# Altium project PCB_Project.PrjPcb
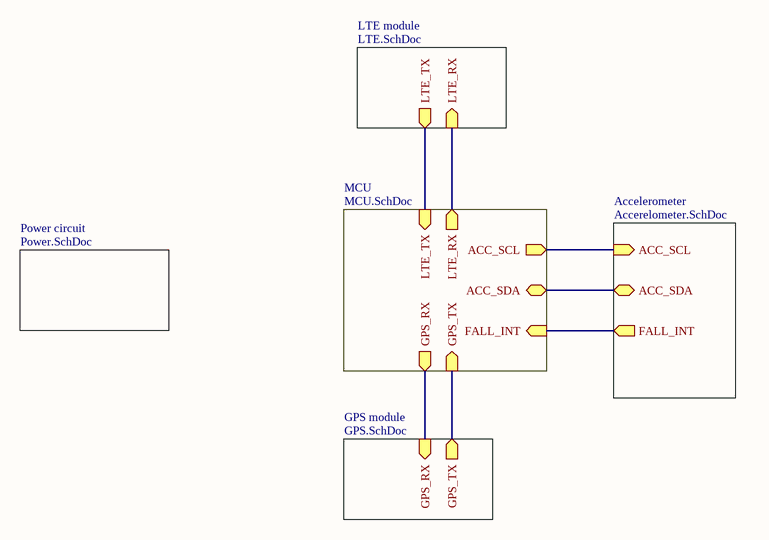
[diagram p0: Block digram.SchDoc]
6 sheets, 107 parts. Net scope: hierarchical (ports join the sheet entries above them; power ports are global).
Board file: PCB_v1.PcbDoc
Sheets:
  Block digram.SchDoc
    Power circuit = Power.SchDoc
    Accelerometer = Accerelometer.SchDoc
    GPS module = GPS.SchDoc
    LTE module = LTE.SchDoc
    MCU = MCU.SchDoc

## Sheet Block digram.SchDoc: Block diagram
size A4; Date: 3-7-2020; Author: Tim Chien; DrawnBy: Tim Chien; DocumentNumber: 1; Revision: 1-1; SheetNumber: 1; SheetTotal: 6; Time: 23:47

### Sub-sheets
Accelerometer = Accerelometer.SchDoc: ACC_SCL (in), ACC_SDA (bidir), FALL_INT (out)
GPS module = GPS.SchDoc: GPS_TX (out), GPS_RX (in)
LTE module = LTE.SchDoc: LTE_TX (out), LTE_RX (in)
MCU = MCU.SchDoc: GPS_RX (out), GPS_TX (in), ACC_SCL (out), ACC_SDA (bidir), FALL_INT (in), LTE_TX (in), LTE_RX (out)
Power circuit = Power.SchDoc: no entries

### Nets
ACC_SCL: sheet Accelerometer/ACC_SCL, sheet MCU/ACC_SCL
ACC_SDA: sheet Accelerometer/ACC_SDA, sheet MCU/ACC_SDA
FALL_INT: sheet Accelerometer/FALL_INT, sheet MCU/FALL_INT
GPS_RX: sheet GPS module/GPS_RX, sheet MCU/GPS_RX
GPS_TX: sheet GPS module/GPS_TX, sheet MCU/GPS_TX
LTE_RX: sheet LTE module/LTE_RX, sheet MCU/LTE_RX
LTE_TX: sheet LTE module/LTE_TX, sheet MCU/LTE_TX

### Notes on the sheet
- Title
- Size:
- Date:
- A4
- Number:
- Time:
- Revision:
- Sheet
- of
- File:

## Sheet Power.SchDoc: Power circuit
size A4; Revision: 1-1; SheetNumber: 2; SheetTotal: 6
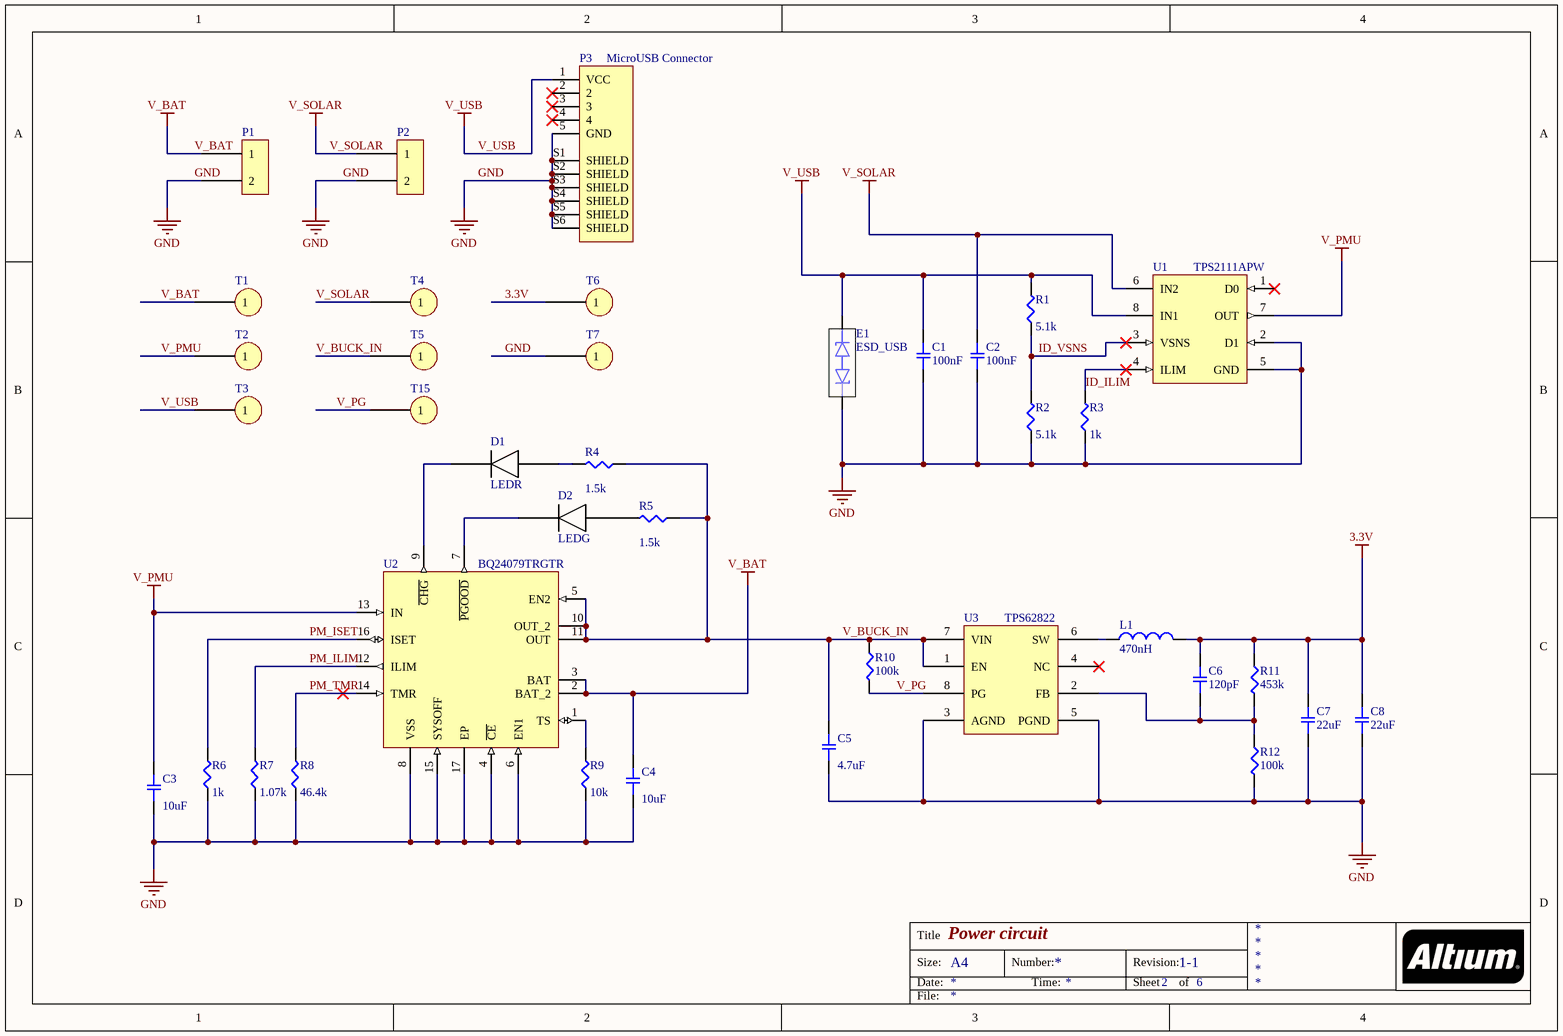
[diagram p1: Power.SchDoc]

### Parts
C1  value 100nF  [1206-CAP]  (hidden comment: 1206C 100NF)
C2  value 100nF  [1206-CAP]  (hidden comment: 1206C 100NF)
C3  value 10uF  [0805-CAP]  (hidden comment: 0805C 10UF)
C4  value 10uF  [0805-CAP]  (hidden comment: 0805C 10UF)
C5  value 4.7uF  [0603-CAP]  (hidden comment: 0603C 4U7F)
C6  value 120pF  [0603-CAP]  (hidden comment: 0603C 120PF)
C7  value 22uF  [1210-CAP]  (hidden comment: 1210C 22UF)
C8  value 22uF  [1210-CAP]  (hidden comment: 1210C 22UF)
D1  LEDR  [0603-LED]
D2  LEDG  [0603-LED]
E1  ESD_USB  [ESD_USB]
L1  value 470nH  [Inductor 470NH]  (hidden comment: Inductor 470NH)
P1  2pins_connector  [2_PINS_2.54]  (value not drawn)
P2  2pins_connector  [2_PINS_2.54]  (value not drawn)
P3  value MicroUSB Connector  [*HRS_ZX62D-B-5P8_ZX62D-B-5P8(Primary)]  (hidden comment: ZX62D-B-5P8)
R1  value 5.1k  [0805-RES]  (hidden comment: 0805R 5K1R)
R2  value 5.1k  [0805-RES]  (hidden comment: 0805R 5K1R)
R3  value 1k  [0603-RES]  (hidden comment: 0603R 1KR)
R4  value 1.5k  [0603-RES]  (hidden comment: 0603R 1K5R)
R5  value 1.5k  [0603-RES]  (hidden comment: 0603R 1K5R)
R6  value 1k  [0603-RES]  (hidden comment: 0603R 1KR)
R7  value 1.07k  [0603-RES]  (hidden comment: 0603R 1K07R)
R8  value 46.4k  [0603-RES]  (hidden comment: 0603R 46K4R)
R9  value 10k  [0603-RES]  (hidden comment: 0603R 10KR)
R10  value 100k  [0805-RES]  (hidden comment: 0805R 100KR)
R11  value 453k  [0805-RES]  (hidden comment: 0805R 453KR)
R12  value 100k  [0805-RES]  (hidden comment: 0805R 100KR)
T1  1pin_header  [1_PIN_2.54]  (value not drawn)
T2  1pin_header  [1_PIN_2.54]  (value not drawn)
T3  1pin_header  [1_PIN_2.54]  (value not drawn)
T4  1pin_header  [1_PIN_2.54]  (value not drawn)
T5  1pin_header  [1_PIN_2.54]  (value not drawn)
T6  1pin_header  [1_PIN_2.54]  (value not drawn)
T7  1pin_header  [1_PIN_2.54]  (value not drawn)
T15  *  [1_PIN_2.54]  (value not drawn)
U1  TPS2111APW  [*SOP65P640X120-8N]
U2  BQ24079TRGTR  [*QFN50P300X300X100-17N]
U3  TPS62822  [SON50P150X100_HS-9N]

### Nets
3.3V: C6.2 C7.2 C8.2 L1.2 R11.1 T6.1
GND: C1.1 C2.1 C3.1 C4.1 C5.1 C7.1 C8.1 E1.1 P1.2 P2.2 P3.5(GND) P3.S1(SHIELD) P3.S2(SHIELD) P3.S3(SHIELD) P3.S4(SHIELD) P3.S5(SHIELD) P3.S6(SHIELD) R2.1 R3.1 R6.1 R7.1 R8.1 R9.1 R12.2 T7.1 U1.2(D1) U1.5(GND) U2.4(~{CE}) U2.6(EN1) U2.8(VSS) U2.15(SYSOFF) U2.17(EP) U3.3(AGND) U3.5(PGND)
V_BAT: C4.2 P1.1 T1.1 U2.2(BAT_2) U2.3(BAT)
V_PMU: C3.2 T2.1 U1.7(OUT) U2.13(IN)
V_SOLAR: C2.2 P2.1 T4.1 U1.6(IN2)
V_USB: C1.2 E1.2 P3.1(VCC) R1.2 T3.1 U1.8(IN1)
ID_ILIM: R3.2 U1.4(ILIM)
ID_VSNS: R1.1 R2.2 U1.3(VSNS)
PM_ILIM: R7.2 U2.12(ILIM)
PM_ISET: R6.2 U2.16(ISET)
PM_TMR: R8.2 U2.14(TMR)
V_BUCK_IN: C5.2 R4.1 R5.1 R10.1 T5.1 U2.5(EN2) U2.10(OUT_2) U2.11(OUT) U3.1(EN) U3.7(VIN)
V_PG: R10.2 T15.1 U3.8(PG)
NetC6_1: C6.1 R11.2 R12.1 U3.2(FB)
NetD1_1: D1.1 R4.2
NetD1_2: D1.2 U2.9(~{CHG})
NetD2_1: D2.1 R5.2
NetD2_2: D2.2 U2.7(~{PGOOD})
NetL1_1: L1.1 U3.6(SW)
NetR9_2: R9.2 U2.1(TS)

Not connected (* = marked no-connect by the designer): P3 2* 3* 4*; U1 1(D0)*; U3 4(NC)*

### Notes on the sheet
- Title
- Size:
- Date:
- A4
- Number:
- Time:
- Revision:
- Sheet
- of
- File:

### Library data of the parts
D1 = 0603 LEDR: Supplier 1: Digi-Key; Supplier Part Number 1: 160-1181-6-ND
D2 = 0603 LEDG: Supplier 1: Digi-Key; Supplier Part Number 1: 160-1183-6-ND
P1 P2 = 2pins_connector: Bat_connector
P3 = ZX62D-B-5P8: USB - micro B USB 2.0 Receptacle Connector 5 Position Surface Mount, Right Angle; Through Hole; MF: Hirose; SnapEDA_Link: https://www.snapeda.com/parts/ZX62D-B-5P8/Hirose%20Electric%20Co%20Ltd/view-part/110243/?ref=snap; Price: None; Availability: Unavailable; Package: None; MP: ZX62D-B-5P8; Supplier 1: Digi-Key; Supplier Part Number 1: 609-5379-6-ND
T15 = 1pin_header
U1 = TPS2111APW: OR Controller Source Selector Switch N-Channel 2:1 8-TSSOP; MF: Texas Instruments; MP: TPS2110APWR; Package: TSSOP-8 Texas Instruments; Price: 2.34; SnapEDA_Link: https://www.snapeda.com/parts/TPS2111APW/Texas%20Instruments/view-part/299213/?ref=snap; Value: *; datasheet link: https://www.ti.com/lit/ds/symlink/tps2111a.pdf; Digikey link: https://www.digikey.com/product-detail/en/texas-instruments/TPS2110APWR/296-16935-1-ND/652789; Supplier 1: Digi-Key; Supplier Part Number 1: 296-26917-5-ND
U2 = BQ24079TRGTR: MF: Texas Instruments; MP: BQ24079RGTR; SnapEDA_Link: https://www.snapeda.com/parts/BQ24079TRGTR/Texas%20Instruments/view-part/144669/?ref=snap; Value: *; Digikey link: https://www.digikey.com/product-detail/en/texas-instruments/BQ24079RGTR/296-24815-1-ND/2094655; Package: 16-VFQFN Exposed Pad; Price: 2.21; Datasheet link: http://www.ti.com/lit/ds/symlink/bq24079.pdf; Supplier 1: Digi-Key; Supplier Part Number 1: 296-24815-1-ND
U3 = TPS62822: MF: Texas Instruments; MP: TPS62822DLCR; datasheet link: http://www.ti.com/lit/ds/symlink/tps62822.pdf; Digikey number: 296-50424-1-ND; Package: 8-VFDFN; digikey link: https://www.digikey.com/product-detail/en/texas-instruments/TPS62822DLCR/296-50424-1-ND/9685563; Supplier 1: Digi-Key; Supplier Part Number 1: 296-50424-1-ND
C1 C2 = 1206C 100NF: Package: 1206; Supplier 1: Digi-Key; Supplier Part Number 1: 311-1179-6-ND
C3 C4 = 0805C 10UF: Supplier 1: Digi-Key; Supplier Part Number 1: 445-7617-1-ND
C5 = 0603C 4U7F: Supplier 1: Digi-Key; Supplier Part Number 1: 399-3482-1-ND
C6 = 0603C 120PF: Supplier 1: Digi-Key; Supplier Part Number 1: 490-1429-1-ND
C7 C8 = 1210C 22UF: Supplier 1: Digi-Key; Supplier Part Number 1: 490-10560-1-ND
E1 = ESD_USB: Supplier 1: Digi-Key; Supplier Part Number 1: 1727-3838-1-ND
L1 = Inductor 470NH: Supplier 1: Digi-Key; Supplier Part Number 1: 445-3878-1-ND
R1 R2 = 0805R 5K1R: Supplier 1: Digi-Key; Supplier Part Number 1: 2019-RK73H2ATTD5101FCT-ND
R3 R6 = 0603R 1KR: Package: 0603; Supplier 1: Digi-Key; Supplier Part Number 1: 311-1.00KHRDKR-ND
R4 R5 = 0603R 1K5R: Package: 0603; Supplier 1: Digi-Key; Supplier Part Number 1: 311-1.50KHRCT-ND
R7 = 0603R 1K07R: Package: 0603; Supplier 1: Digi-Key; Supplier Part Number 1: 311-1.07KHRCT-ND
R8 = 0603R 46K4R: Package: 0603; Supplier 1: Digi-Key; Supplier Part Number 1: 311-46.4KHRCT-ND
R9 = 0603R 10KR: Package: 0603; Supplier 1: Digi-Key; Supplier Part Number 1: 311-10.0KHRCT-ND
R10 R12 = 0805R 100KR: Supplier 1: Digi-Key; Supplier Part Number 1: P100KCCT-ND
R11 = 0805R 453KR: Supplier 1: Digi-Key; Supplier Part Number 1: P453KCCT-ND

## Sheet Accerelometer.SchDoc: Accelerometer (MMA8452Q) circuit
size A4; Revision: 1-1; SheetNumber: 4; SheetTotal: 6
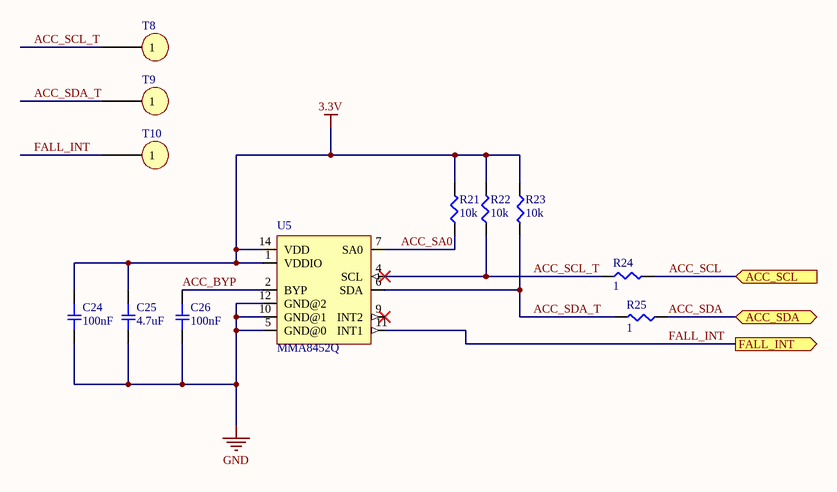
[diagram p2: Accerelometer.SchDoc]

### Parts
C24  value 100nF  [0603-CAP]  (hidden comment: 0603C 100NF)
C25  value 4.7uF  [0603-CAP]  (hidden comment: 0603C 4U7F)
C26  value 100nF  [0603-CAP]  (hidden comment: 0603C 100NF)
R21  value 10k  [0603-RES]  (hidden comment: 0603R 10KR)
R22  value 10k  [0603-RES]  (hidden comment: 0603R 10KR)
R23  value 10k  [0603-RES]  (hidden comment: 0603R 10KR)
R24  value 1  [0603-RES]  (hidden comment: 0603R 1R)
R25  value 1  [0603-RES]  (hidden comment: 0603R 1R)
T8  1pin_test  [1_PIN_test]  (value not drawn)
T9  1pin_test  [1_PIN_test]  (value not drawn)
T10  1pin_test  [1_PIN_test]  (value not drawn)
U5  MMA8452Q  [*QFN-16_0.5MM]

### Ports
ACC_SCL (in), ACC_SDA (bidir), FALL_INT (out)

### Nets
3.3V: C24.1 C25.1 R21.2 R22.2 R23.1 U5.1(VDDIO) U5.14(VDD)
GND: C24.2 C25.2 C26.2 U5.5(GND@0) U5.10(GND@1) U5.12(GND@2)
ACC_BYP: C26.1 U5.2(BYP)
ACC_SA0: R21.1 U5.7(SA0)
ACC_SCL: R24.2 ; port ACC_SCL
ACC_SCL_T: R22.1 R24.1 T8.1 U5.4(SCL)
ACC_SDA: R25.1 ; port ACC_SDA
ACC_SDA_T: R23.2 R25.2 T9.1 U5.6(SDA)
FALL_INT: T10.1 U5.11(INT1) ; port FALL_INT

Not connected (* = marked no-connect by the designer): U5 9(INT2)*

### Notes on the sheet
- Title
- Size:
- Date:
- A4
- Number:
- Time:
- Revision:
- Sheet
- of
- File:

### Library data of the parts
U5 = MMA8452Q: Accelerometer X, Y, Z Axis , 2g, 4g, 8g 0.78Hz ~ 400Hz 16-QFN _3x3_; MP: MMA8452QR1; MF: NXP Semiconductors; Price: 1.147; Package: 16-VFQFN; Availability: Unavailable; SnapEDA_Link: https://www.snapeda.com/parts/MMA8452Q/NXP%20Semiconductors/view-part/4219708/?ref=snap; Value: *; Digikey link: https://www.digikey.com/product-detail/en/nxp-usa-inc/MMA8452QR1/MMA8452QR1TR-ND/2508917; Datasheet link: https://www.nxp.com/docs/en/data-sheet/MMA8451Q.pdf; Supplier 1: Digi-Key; Supplier Part Number 1: MMA8452QR1CT-ND
C24 C26 = 0603C 100NF: Supplier 1: Digi-Key; Supplier Part Number 1: 490-8020-1-ND
C25 = 0603C 4U7F: Supplier 1: Digi-Key; Supplier Part Number 1: 399-3482-1-ND
R21-R23 = 0603R 10KR: Package: 0603; Supplier 1: Digi-Key; Supplier Part Number 1: 311-10.0KHRCT-ND
R24 R25 = 0603R 1R: Package: 0603; Supplier 1: Digi-Key; Supplier Part Number 1: 311-1.00HRCT-ND

## Sheet GPS.SchDoc: GPS (SAM-M8Q) circuit
size A4; Revision: 1-1; SheetNumber: 5; SheetTotal: 6
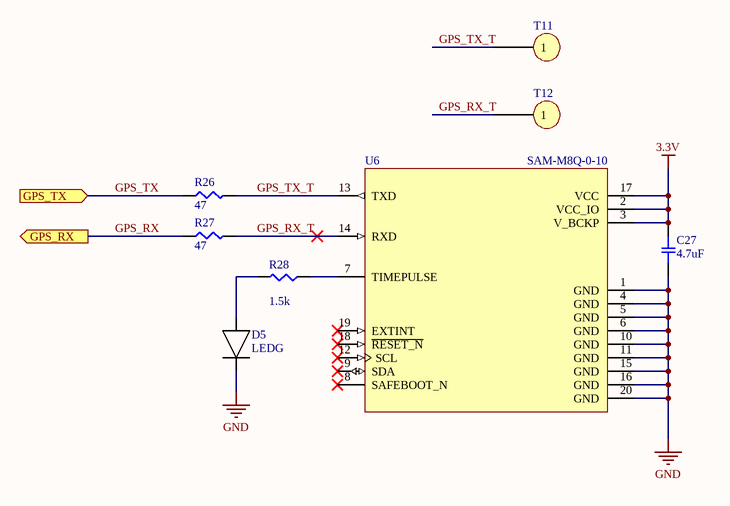
[diagram p3: GPS.SchDoc]

### Parts
C27  value 4.7uF  [0603-CAP]  (hidden comment: 0603C 4U7F)
D5  LEDG  [0603-LED]
R26  value 47  [0603-RES]  (hidden comment: 0603R 47R)
R27  value 47  [0603-RES]  (hidden comment: 0603R 47R)
R28  value 1.5k  [0603-RES]  (hidden comment: 0603R 1K5R)
T11  *  [1_PIN_test]  (value not drawn)
T12  *  [1_PIN_test]  (value not drawn)
U6  SAM-M8Q-0-10  [SAMM8Q010]

### Ports
GPS_RX (out), GPS_TX (in)

### Nets
3.3V: C27.1 U6.2(VCC_IO) U6.3(V_BCKP) U6.17(VCC)
GND: C27.2 D5.2 U6.1(GND) U6.4(GND) U6.5(GND) U6.6(GND) U6.10(GND) U6.11(GND) U6.15(GND) U6.16(GND) U6.20(GND)
GPS_RX: R27.1 ; port GPS_RX
GPS_RX_T: R27.2 T12.1 U6.14(RXD)
GPS_TX: R26.1 ; port GPS_TX
GPS_TX_T: R26.2 T11.1 U6.13(TXD)
NetD5_1: D5.1 R28.2
NetR28_1: R28.1 U6.7(TIMEPULSE)

Not connected (* = marked no-connect by the designer): U6 8(SAFEBOOT_N)* 9(SDA)* 12(SCL)* 18(~{RESET_N})* 19(EXTINT)*

### Notes on the sheet
- Title
- Size:
- Date:
- A4
- Number:
- Time:
- Revision:
- Sheet
- of
- File:

### Library data of the parts
D5 = 0603 LEDG: Supplier 1: Digi-Key; Supplier Part Number 1: 160-1183-6-ND; Value: LEDG
T11 T12 = 1pin_header
U6 = SAM-M8Q-0-10: CAM-M8 RF Receiver BeiDou, GLONASS, GNSS, GPS 1.575GHz -167dBm On-Board, Chip Module; MF: U-Blox America; SnapEDA_Link: https://www.snapeda.com/parts/SAM-M8Q-0-10/U-Blox%20America/view-part/?ref=search&t=SAM-M8Q-0-10; MP: SAM-M8Q-0-10; Package: 20-SMD Module; Digi-Key_Part_Number: 672-1054-1-ND; Digi-Key_Purchase_URL: https://www.digikey.com/product-detail/en/u-blox-america-inc/SAM-M8Q-0-10/672-1054-1-ND/7393573; Value: *; datasheet link: https://www.u-blox.com/sites/default/files/SAM-M8Q_HardwareIntegrationManual_%28UBX-16018358%29.pdf; Price: 25; Supplier 1: Digi-Key; Supplier Part Number 1: 672-1054-1-ND
C27 = 0603C 4U7F: Supplier 1: Digi-Key; Supplier Part Number 1: 399-3482-1-ND
R26 R27 = 0603R 47R: Package: 0603; Supplier 1: Digi-Key; Supplier Part Number 1: 311-47.0HRDKR-ND
R28 = 0603R 1K5R: Package: 0603; Supplier 1: Digi-Key; Supplier Part Number 1: 311-1.50KHRCT-ND

## Sheet LTE.SchDoc: LTE (XB3-C-A1-UT) circuit
size A4; Author: Tim Chien; Revision: 1-1; SheetNumber: 6; SheetTotal: 6
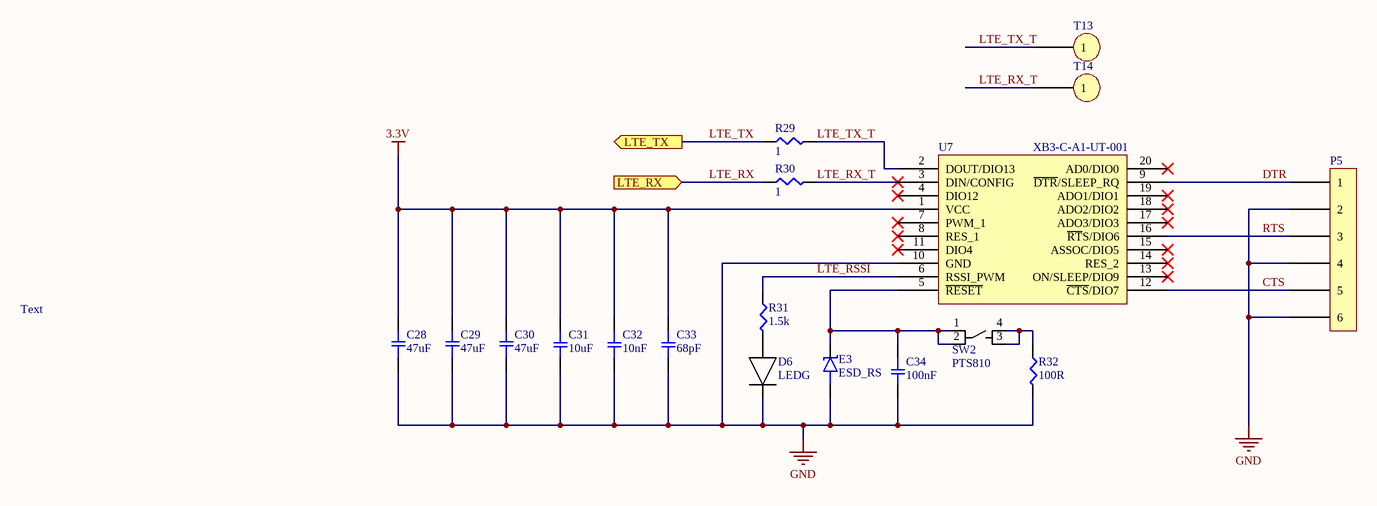
[diagram p4: LTE.SchDoc]

### Parts
C28  47uF  [0805-CAP]
C29  47uF  [0805-CAP]
C30  47uF  [0805-CAP]
C31  value 10uF  [0603-CAP]  (hidden comment: 0603C 10UF)
C32  value 10nF  [0603-CAP]  (hidden comment: 0603C 10NF)
C33  value 68pF  [0603-CAP]  (hidden comment: 0603C 68PF)
C34  value 100nF  [0603-CAP]  (hidden comment: 0603C 100NF)
D6  LEDG  [0603-LED]
E3  ESD_RS  [ESD_RS]
P5  6pins_connector  [6_PINS_2.54]  (value not drawn)
R29  value 1  [0603-RES]  (hidden comment: 0603R 1R)
R30  value 1  [0603-RES]  (hidden comment: 0603R 1R)
R31  value 1.5k  [0603-RES]  (hidden comment: 0603R 1K5R)
R32  value 100R  [0603-RES]  (hidden comment: 0603R 100R)
SW2  PTS810  [*SW_PTS810_SJM_250_SMTR_LFS]
T13  *  [1_PIN_test]  (value not drawn)
T14  *  [1_PIN_test]  (value not drawn)
U7  XB3-C-A1-UT-001  [XB24CAPIT-001]

### Ports
LTE_RX (in), LTE_TX (out)

### Nets
3.3V: C28.2 C29.2 C30.2 C31.1 C32.1 C33.1 U7.1(VCC)
GND: C28.1 C29.1 C30.1 C31.2 C32.2 C33.2 C34.2 D6.2 E3.2 P5.2 P5.4 P5.6 R32.2 U7.10(GND)
CTS: P5.5 U7.12(~{CTS}/DIO7)
DTR: P5.1 U7.9(~{DTR}/SLEEP_RQ)
LTE_RSSI: R31.1 U7.6(RSSI_PWM)
LTE_RX: R30.1 ; port LTE_RX
LTE_RX_T: R30.2 T14.1 U7.3(DIN/CONFIG)
LTE_TX: R29.1 ; port LTE_TX
LTE_TX_T: R29.2 T13.1 U7.2(DOUT/DIO13)
RTS: P5.3 U7.16(~{RT}S/DIO6)
NetC34_1: C34.1 E3.1 SW2.1 SW2.2 U7.5(~{RESET})
NetD6_1: D6.1 R31.2
NetR32_1: R32.1 SW2.3 SW2.4

Not connected (* = marked no-connect by the designer): U7 4(DIO12)* 7(PWM_1)* 8(RES_1)* 11(DIO4)* 13(ON/SLEEP/DIO9)* 14(RES_2)* 15(ASSOC/DIO5)* 17(ADO3/DIO3)* 18(ADO2/DIO2)* 19(ADO1/DIO1)* 20(AD0/DIO0)*

### Notes on the sheet
- Text
- Title
- Size:
- Date:
- A4
- Number:
- Time:
- Revision:
- Sheet
- of
- File:

### Library data of the parts
C28-C30 = 0805C 47UF: Supplier 1: Digi-Key; Supplier Part Number 1: 490-9949-1-ND; Value: 47uF
D6 = 0603 LEDG: Supplier 1: Digi-Key; Supplier Part Number 1: 160-1183-6-ND; Value: LEDG
E3 = ESD_RESET: Supplier 1: Digi-Key; Supplier Part Number 1: F7701CT-ND
SW2 = PTS810_SJM_250_SMTR_LFS: Tactile Switch SPST-NO Top Actuated Surface Mount; MP: PTS810 SJM 250 SMTR LFS; MF: C&K; Availability: Unavailable; Package: None; Price: 0.3; SnapEDA_Link: https://www.snapeda.com/parts/PTS810%20SJM%20250%20SMTR%20LFS/C%26K/view-part/522770/?ref=snap; Value: *; Digikey link: https://www.digikey.com/product-detail/en/c-k/PTS810-SJM-250-SMTR-LFS/CKN10502CT-ND/4176673; Digikey part number: CKN10502CT-ND
T13 T14 = 1pin_header
U7 = XB3-C-A1-UT-001: MF: Digi; Digikey link: https://www.digikey.com/product-detail/en/digi/XB3-C-A1-UT-001/602-2211-ND/8109033; Digikey part number: 602-2211-ND; MP: XB3-C-A1-UT-001; Package: 20-SMD Module; Price: 99; Datasheet link: https://www.digi.com/pdf/ds_xbee3-cellular-cat1.pdf
C31 = 0603C 10UF: Supplier 1: Digi-Key; Supplier Part Number 1: 490-10474-1-ND
C32 = 0603C 10NF: Supplier 1: Digi-Key; Supplier Part Number 1: 490-8028-1-ND
C33 = 0603C 68PF: Supplier 1: Digi-Key; Supplier Part Number 1: 311-4039-1-ND
C34 = 0603C 100NF: Supplier 1: Digi-Key; Supplier Part Number 1: 490-8020-1-ND
R29 R30 = 0603R 1R: Package: 0603; Supplier 1: Digi-Key; Supplier Part Number 1: 311-1.00HRCT-ND
R31 = 0603R 1K5R: Package: 0603; Supplier 1: Digi-Key; Supplier Part Number 1: 311-1.50KHRCT-ND
R32 = 0603R 100R: Package: 0603; Supplier 1: Digi-Key; Supplier Part Number 1: 311-100HRCT-ND

## Sheet MCU.SchDoc: MCU(EFM32PG12) circuit
size A4; Revision: 1-1; SheetNumber: 3; SheetTotal: 6
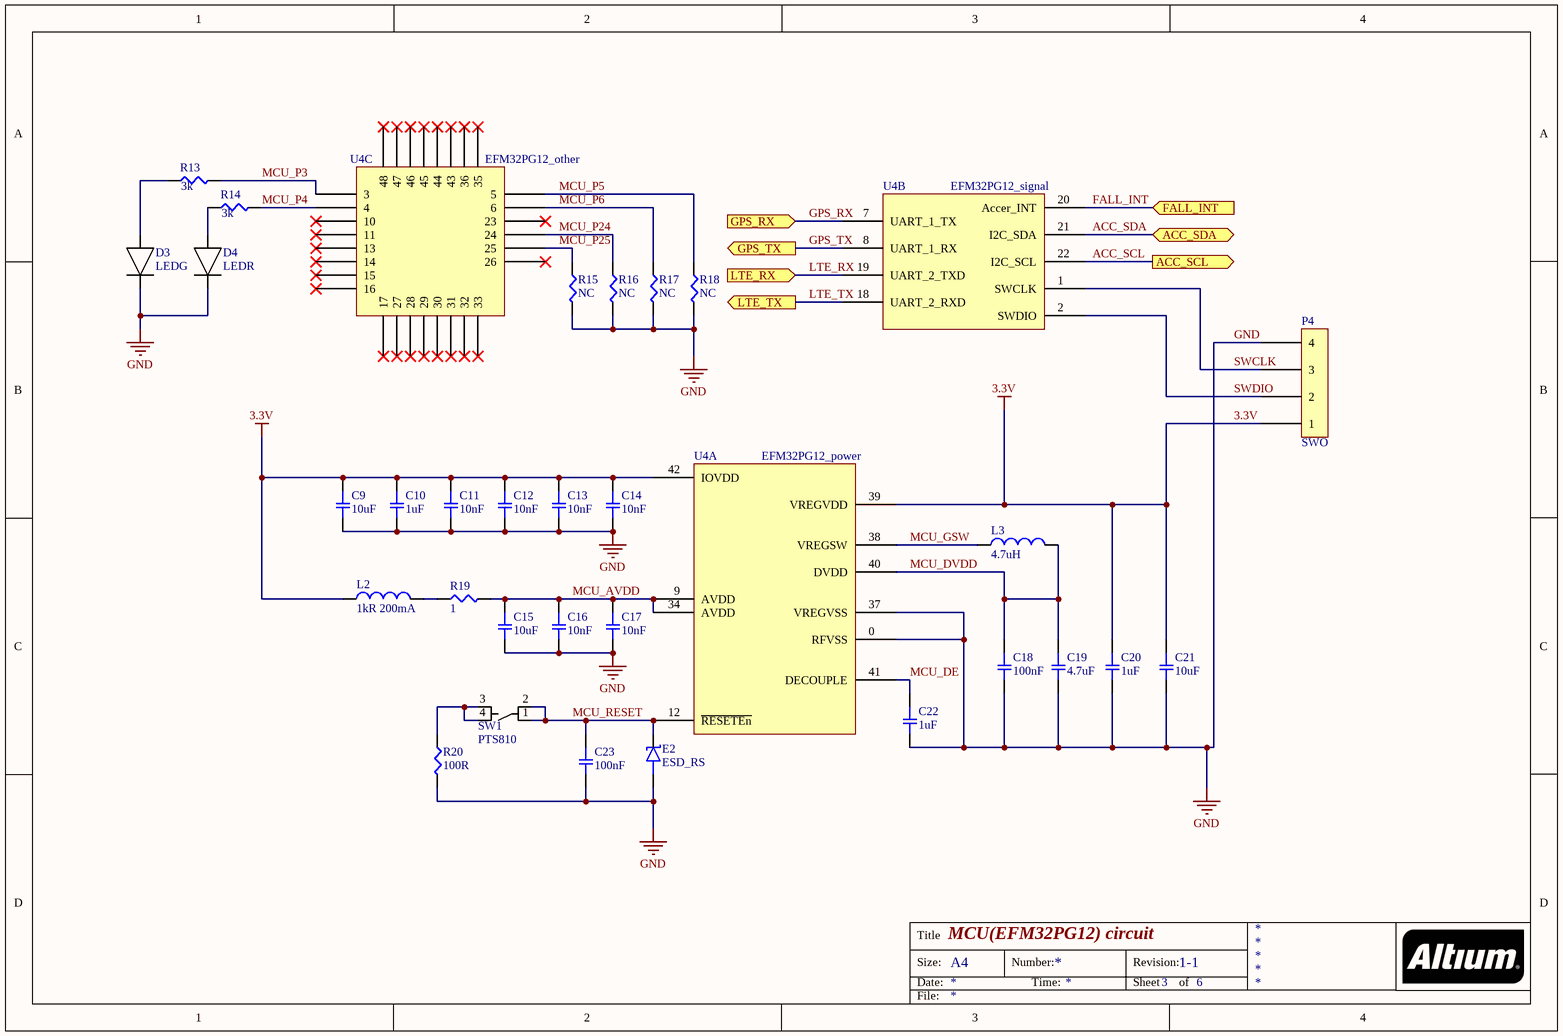
[diagram p5: MCU.SchDoc]

### Parts
C9  value 10uF  [0603-CAP]  (hidden comment: 0603C 10UF)
C10  value 1uF  [0603-CAP]  (hidden comment: 0603C 1UF)
C11  value 10nF  [0603-CAP]  (hidden comment: 0603C 10NF)
C12  value 10nF  [0603-CAP]  (hidden comment: 0603C 10NF)
C13  value 10nF  [0603-CAP]  (hidden comment: 0603C 10NF)
C14  value 10nF  [0603-CAP]  (hidden comment: 0603C 10NF)
C15  value 10uF  [0603-CAP]  (hidden comment: 0603C 10UF)
C16  value 10nF  [0603-CAP]  (hidden comment: 0603C 10NF)
C17  value 10nF  [0603-CAP]  (hidden comment: 0603C 10NF)
C18  value 100nF  [0603-CAP]  (hidden comment: 0603C 100NF)
C19  value 4.7uF  [0603-CAP]  (hidden comment: 0603C 4U7F)
C20  value 1uF  [0603-CAP]  (hidden comment: 0603C 1UF)
C21  value 10uF  [0603-CAP]  (hidden comment: 0603C 10UF)
C22  value 1uF  [0603-CAP]  (hidden comment: 0603C 1UF)
C23  value 100nF  [0603-CAP]  (hidden comment: 0603C 100NF)
D3  LEDG  [0603-LED]
D4  LEDR  [0603-LED]
E2  ESD_RS  [ESD_RS]
L2  value 1kR 200mA  [0603-FerritBead]  (hidden comment: Ferrite Bead)
L3  value 4.7uH  [Inductor 4U7H]  (hidden comment: Inductor 4U7H)
P4  SWO  [4_PINS_2.54]
R13  value 3k  [0603-RES]  (hidden comment: 3KR)
R14  value 3k  [0603-RES]  (hidden comment: 3KR)
R15  value NC  [0603-RES]  (hidden comment: 0603R NC)
R16  value NC  [0603-RES]  (hidden comment: 0603R NC)
R17  value NC  [0603-RES]  (hidden comment: 0603R NC)
R18  value NC  [0603-RES]  (hidden comment: 0603R NC)
R19  value 1  [0603-RES]  (hidden comment: 0603R 1R)
R20  value 100R  [0603-RES]  (hidden comment: 0603R 100R)
SW1  PTS810  [*SW_PTS810_SJM_250_SMTR_LFS]
U4  EFM32PG12_power  [QFN50P700X700X90_HS-49N_]  (parts A,B,C of 3)

### Ports
ACC_SCL (out), ACC_SDA (bidir), FALL_INT (in), GPS_RX (in), GPS_TX (out), LTE_RX (in), LTE_TX (out)

### Nets
3.3V: C9.1 C10.1 C11.1 C12.1 C13.1 C14.1 C20.1 C21.1 L2.1 P4.1 U4.39(VREGVDD) U4.42(IOVDD)
GND: C9.2 C10.2 C11.2 C12.2 C13.2 C14.2 C15.2 C16.2 C17.2 C18.2 C19.2 C20.2 C21.2 C22.2 C23.2 D3.2 D4.2 E2.2 P4.4 R15.2 R16.2 R17.2 R18.2 R20.2 U4.0(RFVSS) U4.37(VREGVSS)
ACC_SCL: U4.22(I2C_SCL) ; port ACC_SCL
ACC_SDA: U4.21(I2C_SDA) ; port ACC_SDA
FALL_INT: U4.20(Accer_INT) ; port FALL_INT
GPS_RX: U4.7(UART_1_TX) ; port GPS_RX
GPS_TX: U4.8(UART_1_RX) ; port GPS_TX
LTE_RX: U4.19(UART_2_TXD) ; port LTE_RX
LTE_TX: U4.18(UART_2_RXD) ; port LTE_TX
MCU_AVDD: C15.1 C16.1 C17.1 R19.2 U4.9(AVDD) U4.34(AVDD)
MCU_DE: C22.1 U4.41(DECOUPLE)
MCU_DVDD: C18.1 C19.1 L3.2 U4.40(DVDD)
MCU_GSW: L3.1 U4.38(VREGSW)
MCU_P3: R13.2 U4.3
MCU_P4: R14.2 U4.4
MCU_P5: R18.1 U4.5
MCU_P6: R17.1 U4.6
MCU_P24: R16.1 U4.24
MCU_P25: R15.1 U4.25
MCU_RESET: C23.1 E2.1 SW1.1 SW1.2 U4.12(~{RESETEn})
SWCLK: P4.3 U4.1(SWCLK)
SWDIO: P4.2 U4.2(SWDIO)
NetD3_1: D3.1 R13.1
NetD4_1: D4.1 R14.1
NetL2_2: L2.2 R19.1
NetR20_1: R20.1 SW1.3 SW1.4

Not connected (* = marked no-connect by the designer): U4 10* 11* 13* 14* 15* 16* 17* 23* 26* 27* 28* 29* 30* 31* 32* 33* 35* 36* 43* 44* 45* 46* 47* 48*

### Notes on the sheet
- Title
- Size:
- Date:
- A4
- Number:
- Time:
- Revision:
- Sheet
- of
- File:

### Library data of the parts
D3 = 0603 LEDG: Supplier 1: Digi-Key; Supplier Part Number 1: 160-1183-6-ND; Value: LEDG
D4 = 0603 LEDR: Supplier 1: Digi-Key; Supplier Part Number 1: 160-1181-6-ND; Value: LEDR
E2 = ESD_RESET: Supplier 1: Digi-Key; Supplier Part Number 1: F7701CT-ND
P4 = 4pins_connector
R13 R14 = 0603R 3KR: Supplier 1: Digi-Key; Supplier Part Number 1: 311-3.00KHRCT-ND
SW1 = PTS810_SJM_250_SMTR_LFS: as SW2 on sheet LTE; Availability: Unavailable; Package: None; Price: 0.3; SnapEDA_Link: https://www.snapeda.com/parts/PTS810%20SJM%20250%20SMTR%20LFS/C%26K/view-part/522770/?ref=snap; Value: *; Digikey link: https://www.digikey.com/product-detail/en/c-k/PTS810-SJM-250-SMTR-LFS/CKN10502CT-ND/4176673; Digikey part number: CKN10502CT-ND
U4 = EFM32PG12: MP: EFM32PG12B500F1024GM48-C; MF: Silicon Labs; Digikey link: https://www.digikey.com/product-detail/en/silicon-labs/EFM32PG12B500F1024GM48-C/336-4419-ND/8186199; Digikey part number: 336-4419-ND; Datasheet link: https://www.silabs.com/documents/public/data-sheets/efm32pg12-datasheet.pdf; Package: 48-VFQFN Exposed Pad; Price: 4.43; Supplier 1: Digi-Key; Supplier Part Number 1: 336-4419-ND
C9 C15 C21 = 0603C 10UF: Supplier 1: Digi-Key; Supplier Part Number 1: 490-10474-1-ND
C10 C20 C22 = 0603C 1UF: Supplier 1: Digi-Key; Supplier Part Number 1: 490-6408-1-ND
C11-C14 C16 C17 = 0603C 10NF: Supplier 1: Digi-Key; Supplier Part Number 1: 490-8028-1-ND
C18 C23 = 0603C 100NF: Supplier 1: Digi-Key; Supplier Part Number 1: 490-8020-1-ND
C19 = 0603C 4U7F: Supplier 1: Digi-Key; Supplier Part Number 1: 399-3482-1-ND
L2 = Ferrite Bead: Supplier 1: Digi-Key; Supplier Part Number 1: 732-4484-1-ND
L3 = Inductor 4U7H: Supplier 1: Digi-Key; Supplier Part Number 1: 490-15954-1-ND
R15-R18 = 0603R NC: Package: 0603
R19 = 0603R 1R: Package: 0603; Supplier 1: Digi-Key; Supplier Part Number 1: 311-1.00HRCT-ND
R20 = 0603R 100R: Package: 0603; Supplier 1: Digi-Key; Supplier Part Number 1: 311-100HRCT-ND

## Nets that join several sheets
3.3V: Power (6 pins), Accerelometer (7 pins), GPS (C27.1 U6.2 U6.3 U6.17), LTE (7 pins), MCU (12 pins)
GND: Power (34 pins), Accerelometer (6 pins), GPS (11 pins), LTE (14 pins), MCU (26 pins)
ACC_SCL: Accerelometer (R24.2), MCU (U4.22)
ACC_SDA: Accerelometer (R25.1), MCU (U4.21)
FALL_INT: Accerelometer (T10.1 U5.11), MCU (U4.20)
GPS_RX: GPS (R27.1), MCU (U4.7)
GPS_TX: GPS (R26.1), MCU (U4.8)
LTE_RX: LTE (R30.1), MCU (U4.19)
LTE_TX: LTE (R29.1), MCU (U4.18)